# EAGLE design LightShaker-3 (EAGLE 6.6.0)
DATE: 18.07.2019; ENGINEER: ChrLin00; PAGE_TITLE: Overview; PCB_NO: E1962100; PROJECT_TITLE: LightShaker; SCH_NO: B1962200
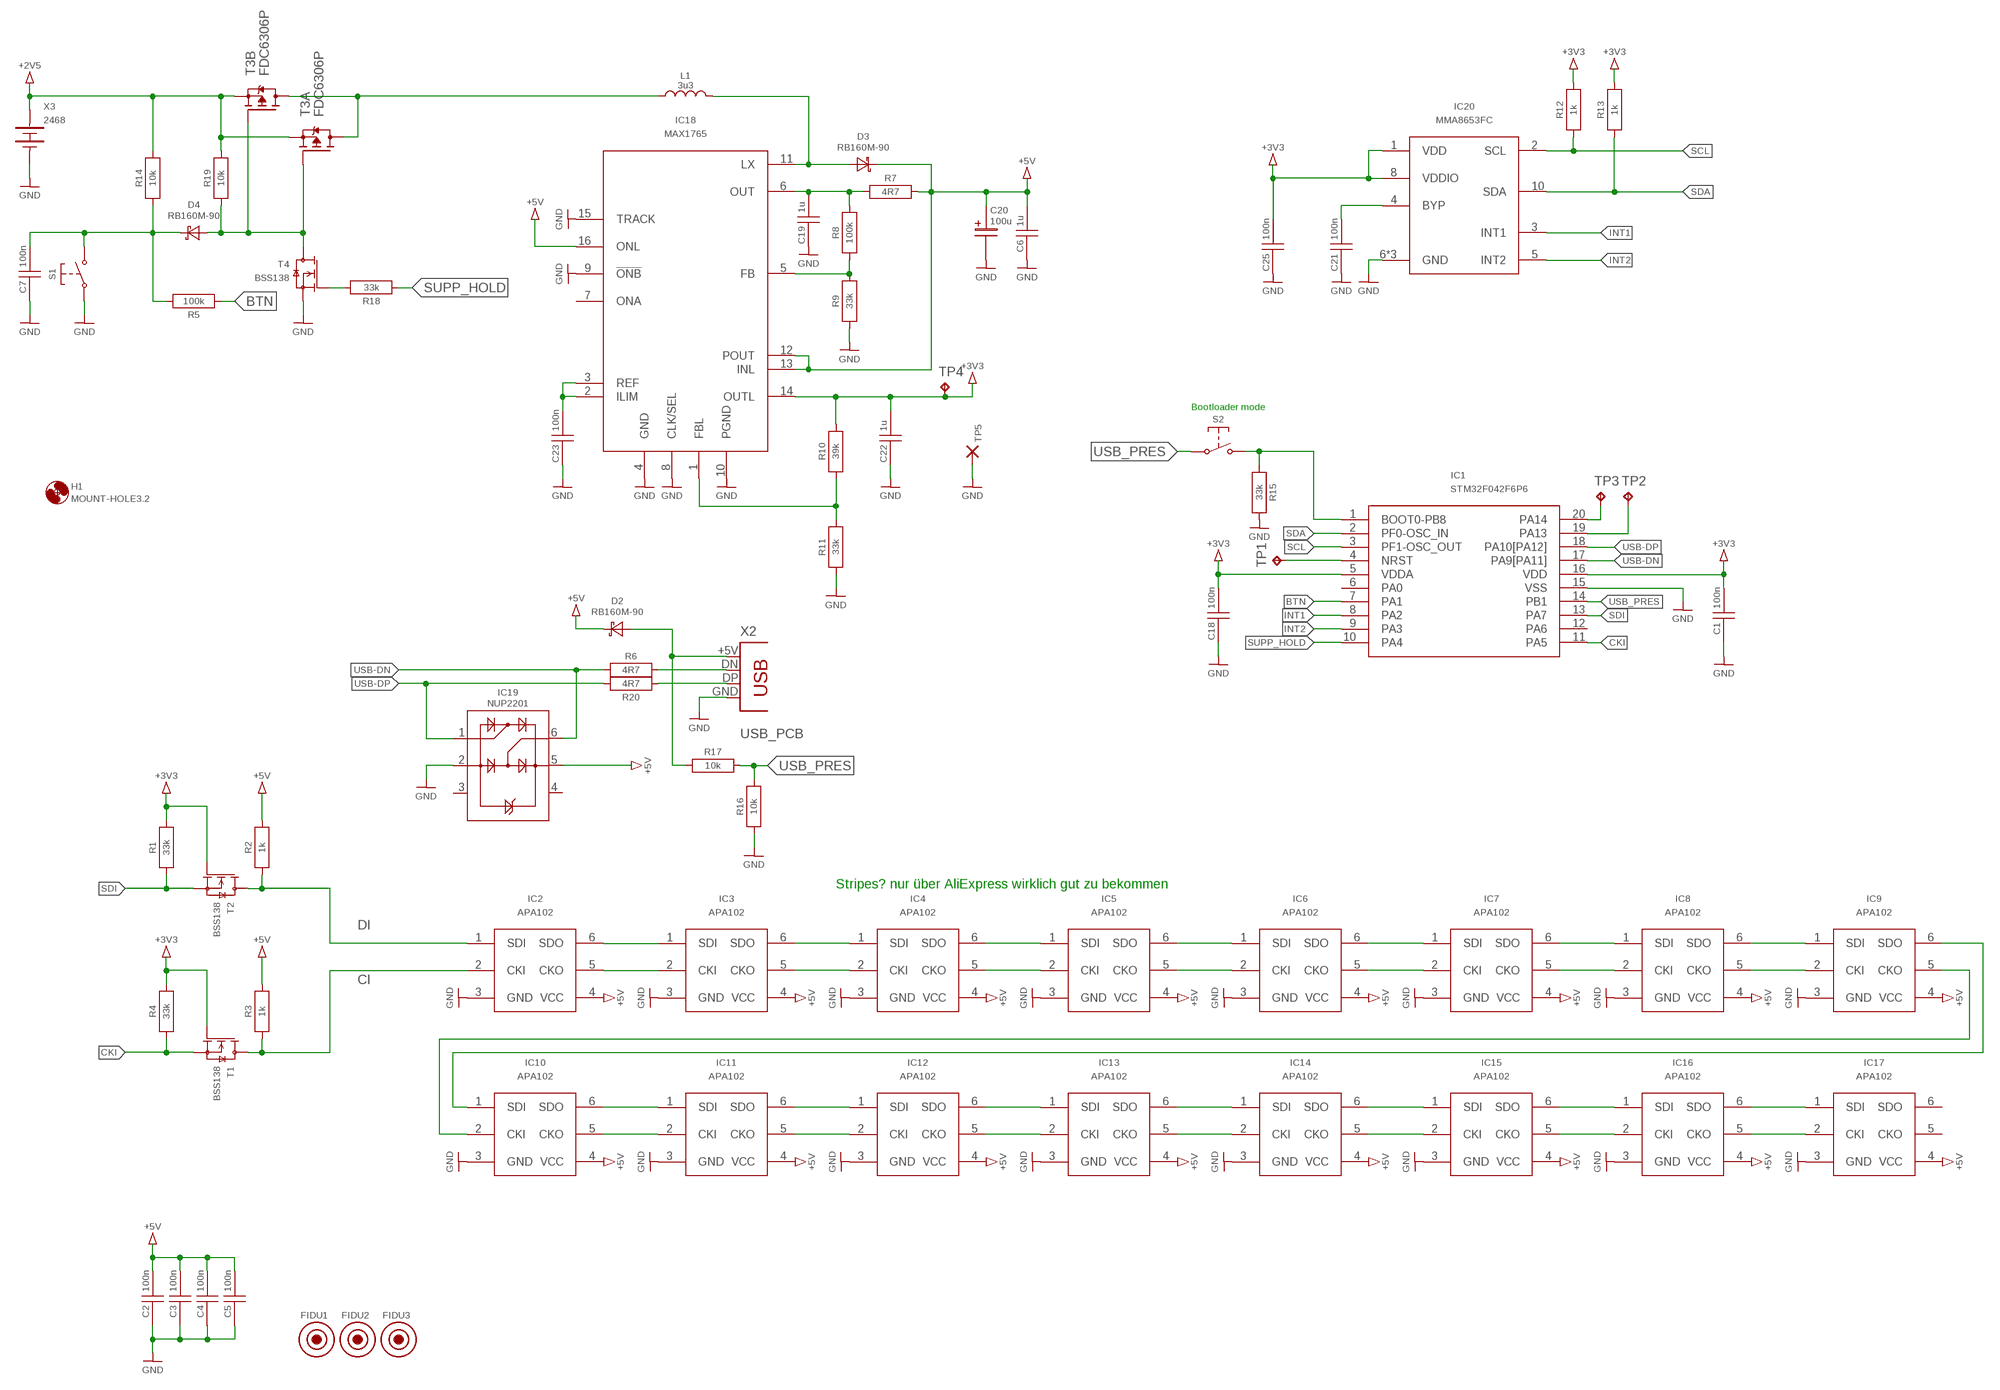
[diagram p0: schematic, sheet 1]

## Parts
C1  100n  C1206  [SM_1206]
C2  100n  C1206  [SM_1206]
C3  100n  C1206  [SM_1206]
C4  100n  C1206  [SM_1206]
C5  100n  C1206  [SM_1206]
C6  1u  C1206  [SM_1206]
C7  100n  C1206  [SM_1206]
C18  100n  C1206  [SM_1206]
C19  1u  C1206  [SM_1206]
C20  100u  CPOLSIZE-D  [SM_SIZE-D]
C21  100n  C1206  [SM_1206]
C22  1u  C1206  [SM_1206]
C23  100n  C1206  [SM_1206]
C25  100n  C1206  [SM_1206]
D2  RB160M-90  [SM_SOD123_POL]
D3  RB160M-90  [SM_SOD123_POL]
D4  RB160M-90  [SM_SOD123_POL]
FIDU1  FIDU_ROUND_NEW  [FIDUCIAL_LOETSTOPP]
FIDU2  FIDU_ROUND_NEW  [FIDUCIAL_LOETSTOPP]
FIDU3  FIDU_ROUND_NEW  [FIDUCIAL_LOETSTOPP]
H1  MOUNT-HOLE3.2  [3.2]
IC1  STM32F042F6P6  [SM_TSSOP20]
IC2  APA102  [SM_LED_PLCC6]
IC3  APA102  [SM_LED_PLCC6]
IC4  APA102  [SM_LED_PLCC6]
IC5  APA102  [SM_LED_PLCC6]
IC6  APA102  [SM_LED_PLCC6]
IC7  APA102  [SM_LED_PLCC6]
IC8  APA102  [SM_LED_PLCC6]
IC9  APA102  [SM_LED_PLCC6]
IC10  APA102  [SM_LED_PLCC6]
IC11  APA102  [SM_LED_PLCC6]
IC12  APA102  [SM_LED_PLCC6]
IC13  APA102  [SM_LED_PLCC6]
IC14  APA102  [SM_LED_PLCC6]
IC15  APA102  [SM_LED_PLCC6]
IC16  APA102  [SM_LED_PLCC6]
IC17  APA102  [SM_LED_PLCC6]
IC18  MAX1765  [SM_QSOP16]
IC19  NUP2201  [TSOP6]
IC20  MMA8653FC  [SM_DFN10]
L1  3u3  L_MOS6020  [SM_L_MOS6020]
R1  33k  R1206  [SM_1206]
R2  1k  R1206  [SM_1206]
R3  1k  R1206  [SM_1206]
R4  33k  R1206  [SM_1206]
R5  100k  R1206  [SM_1206]
R6  4R7  R1206  [SM_1206]
R7  4R7  R1206  [SM_1206]
R8  100k  R1206  [SM_1206]
R9  33k  R1206  [SM_1206]
R10  39k  R1206  [SM_1206]
R11  33k  R1206  [SM_1206]
R12  1k  R1206  [SM_1206]
R13  1k  R1206  [SM_1206]
R14  10k  R1206  [SM_1206]
R15  33k  R1206  [SM_1206]
R16  10k  R1206  [SM_1206]
R17  10k  R1206  [SM_1206]
R18  33k  R1206  [SM_1206]
R19  10k  R1206  [SM_1206]
R20  4R7  R1206  [SM_1206]
S1  PUSH-BUTTON_SMD  [PUSH-BUTTON_SMD]
S2  PUSH-BUTTON_SMD  [PUSH-BUTTON_SMD]
T1  BSS138  [SM_SOT23]
T2  BSS138  [SM_SOT23]
T3  FDC6306P  [TSOP6]
T4  BSS138  [SM_SOT23]
TP1  TPTP12R  [TP12R]
TP2  TPTP12R  [TP12R]
TP3  TPTP12R  [TP12R]
TP4  TPTP12R  [TP12R]
TP5  CHECKER_1206  [SM_RCW_1206]
X2  USB_PCB  [USB_PCB]
X3  2468  [2468]

## Nets
+2V5: R14.2 R19.2 T3.2(B:S) T3.5(A:S) X3.POS
+3V3: C1.2 C18.2 C22.2 C25.2 IC1.5(VDDA) IC1.16(VDD) IC18.14(OUTL) IC20.1(VDD) IC20.8(VDDIO) R1.2 R4.2 R10.2 R12.2 R13.2 T1.1(G) T2.1(G) TP4.TP
+5V: C2.2 C3.2 C4.2 C5.2 C6.2 C20.POS D2.C D3.C IC2.4(VCC) IC3.4(VCC) IC4.4(VCC) IC5.4(VCC) IC6.4(VCC) IC7.4(VCC) IC8.4(VCC) IC9.4(VCC) IC10.4(VCC) IC11.4(VCC) IC12.4(VCC) IC13.4(VCC) IC14.4(VCC) IC15.4(VCC) IC16.4(VCC) IC17.4(VCC) IC18.12(POUT) IC18.13(INL) IC18.16(ONL) IC19.5(VP) R2.2 R3.2 R7.2
BTN: IC1.7(PA1) R5.1
BTN1: C7.2 D4.C R5.2 R14.1 S1.3(S) S1.4(S)
CI: IC2.2(CKI) R3.1 T1.3(D)
CKI: IC1.11(PA5) R4.1 T1.2(S)
DI: IC2.1(SDI) R2.1 T2.3(D)
GATE: D4.A R19.1 T3.1(A:G) T3.3(B:G) T4.3(D)
GND: C1.1 C2.1 C3.1 C4.1 C5.1 C6.1 C7.1 C18.1 C19.1 C20.NEG C21.1 C22.1 C23.1 C25.1 IC1.15(VSS) IC2.3(GND) IC3.3(GND) IC4.3(GND) IC5.3(GND) IC6.3(GND) IC7.3(GND) IC8.3(GND) IC9.3(GND) IC10.3(GND) IC11.3(GND) IC12.3(GND) IC13.3(GND) IC14.3(GND) IC15.3(GND) IC16.3(GND) IC17.3(GND) IC18.4(GND) IC18.8(CLK/SEL) IC18.9(!ONB) IC18.10(PGND) IC18.15(TRACK) IC19.2(GND) IC20.6(GND) IC20.7(GND) IC20.9(GND) R9.1 R11.1 R15.2 R16.1 S1.1(P) S1.2(P) T4.2(S) TP5.1(P) X2.GND X3.NEG
INT1: IC1.8(PA2) IC20.3(INT1)
INT2: IC1.9(PA3) IC20.5(INT2)
N$1: IC2.6(SDO) IC3.1(SDI)
N$2: IC2.5(CKO) IC3.2(CKI)
N$3: R18.2 T4.1(G)
N$4: IC3.6(SDO) IC4.1(SDI)
N$5: IC3.5(CKO) IC4.2(CKI)
N$6: R20.1 X2.DP
N$7: IC4.6(SDO) IC5.1(SDI)
N$8: IC4.5(CKO) IC5.2(CKI)
N$9: R6.2 X2.DN
N$10: IC6.6(SDO) IC7.1(SDI)
N$11: IC6.5(CKO) IC7.2(CKI)
N$13: IC7.6(SDO) IC8.1(SDI)
N$14: IC7.5(CKO) IC8.2(CKI)
N$15: L1.1 T3.4(B:D) T3.6(A:D)
N$16: IC8.6(SDO) IC9.1(SDI)
N$17: IC8.5(CKO) IC9.2(CKI)
N$18: IC1.4(NRST) TP1.TP
N$19: IC10.6(SDO) IC11.1(SDI)
N$20: IC10.5(CKO) IC11.2(CKI)
N$21: IC1.1(BOOT0-PB8) R15.1 S2.3(S) S2.4(S)
N$22: IC11.6(SDO) IC12.1(SDI)
N$23: IC11.5(CKO) IC12.2(CKI)
N$24: IC1.20(PA14) TP3.TP
N$25: IC12.6(SDO) IC13.1(SDI)
N$26: IC12.5(CKO) IC13.2(CKI)
N$27: IC1.19(PA13) TP2.TP
N$28: IC14.6(SDO) IC15.1(SDI)
N$29: IC14.5(CKO) IC15.2(CKI)
N$31: IC15.6(SDO) IC16.1(SDI)
N$32: IC15.5(CKO) IC16.2(CKI)
N$33: C19.2 IC18.6(OUT) R7.1 R8.2
N$34: IC16.6(SDO) IC17.1(SDI)
N$35: IC16.5(CKO) IC17.2(CKI)
N$36: IC18.5(FB) R8.1 R9.2
N$37: D3.A IC18.11(LX) L1.2
N$38: IC5.5(CKO) IC6.2(CKI)
N$39: IC5.6(SDO) IC6.1(SDI)
N$40: IC18.1(FBL) R10.1 R11.2
N$41: IC9.5(CKO) IC10.2(CKI)
N$42: IC9.6(SDO) IC10.1(SDI)
N$44: IC13.5(CKO) IC14.2(CKI)
N$45: IC13.6(SDO) IC14.1(SDI)
N$46: C21.2 IC20.4(BYP)
N$48: C23.2 IC18.2(ILIM) IC18.3(REF)
SCL: IC1.3(PF1-OSC_OUT) IC20.2(SCL) R12.1
SDA: IC1.2(PF0-OSC_IN) IC20.10(SDA) R13.1
SDI: IC1.13(PA7) R1.1 T2.2(S)
SUPP_HOLD: IC1.10(PA4) R18.1
USB-DN: IC1.17(PA9[PA11]) IC19.6(IO2) R6.1
USB-DP: IC1.18(PA10[PA12]) IC19.1(IO1) R20.2
USB_PRES: IC1.14(PB1) R16.2 R17.2 S2.1(P) S2.2(P)
VUSB: D2.A R17.1 X2.+5V
Unconnected: IC1.6(PA0) IC1.12(PA6) IC17.5(CKO) IC17.6(SDO) IC18.7(ONA) IC19.3(NC1) IC19.4(NC2)

## Notes on the sheet
- Bootloader mode
- Stripes? nur über AliExpress wirklich gut zu bekommen

## Library data of the parts
C1-C5 C7 C18 C21 C23 C25 = DTP_RCL:C: Capacitor IMS: IMS Capacitors <file:\\omicron.at\dfs\GLOBAL\OMICRON\Synergies\Innovation\Components\CompIMS\_html\Capacitor.html> Version Date Employee Description 1.2 2018-10-02 NorChr00 added 2220 Package 1.1 2018-09-11 MarAig00 added 0402 Package 1.0 2015-07-15 ChrRaj00 Initial Version; MECHPART: FALSE; PARTNR: E0001400; PLACEHOLDER: FALSE
C6 C19 C22 = DTP_RCL:C: Capacitor IMS: IMS Capacitors <file:\\omicron.at\dfs\GLOBAL\OMICRON\Synergies\Innovation\Components\CompIMS\_html\Capacitor.html> Version Date Employee Description 1.2 2018-10-02 NorChr00 added 2220 Package 1.1 2018-09-11 MarAig00 added 0402 Package 1.0 2015-07-15 ChrRaj00 Initial Version; MECHPART: FALSE; PARTNR: E0487200; PLACEHOLDER: FALSE
C20 = DTP_RCL:CPOL: Capacitor IMS: IMS Capacitors polarized <file:\\omicron.at\dfs\GLOBAL\OMICRON\Synergies\Innovation\Components\CompIMS\_html\Capacitor_Polarized.html> Version Date Employee Description 1.0 2015-08-26 ChrRaj00 Initial Version; MECHPART: FALSE; PARTNR: E0242200; PLACEHOLDER: FALSE
D2-D4 = Diode:RB160M-90: Diode RB160M-90 Vr = 90V Vf = 0.73V If = 1A Cj = 12pF IMS: E0617200 <file:\\omicron.at\dfs\GLOBAL\OMICRON\Synergies\Innovation\Components\CompIMS\Diode\Schottky\E0617200_RB160M-90\E0617200.html> History Version Date Employee Description 1.0 2015-08-10 ChrRaj00 InitialVersion; PARTNR: E0617200
FIDU1-FIDU3 = DTP_Misc:FIDU_ROUND_NEW: Use this Fiducial for new projects!! Fiducial filled with solder mask Place holder for the partlist - needed for production Put FIDU1 on (0,0) position! History Version Date Employee Description 1.0r0 2018.05.07 NorChr00 Add E-Part "number" for Fiducials 1.0 201?.04.21 ???? Initial Version; PARTNR: E0FIDU00
H1 = DTP_Misc:MOUNT-HOLE: MOUNTING HOLE with drill center marker Version Date Employee Description 1.2 2018-10-04 NorChr00 add attributes "PLACEHOLDER and REMARK -> now they are ignored in P&P and BOM 1.1 2016-01-27 MarStr00 Renamed packages with period instead of comma, to help Excel imports 1.0 2015-12-05 MarStr00 Initial Version, copied from holes.lbr and touched up; PLACEHOLDER: TRUE; REMARK: Mounting hole
IC1 = POVLibrary:STM32F042F6P6; PARTNR: P1480012
IC2-IC17 = POVLibrary:APA102; PARTNR: P1480014
IC18 = POVLibrary:MAX1765; PARTNR: P1480011
IC19 = DTP_IC:NUP2201: ESD Protection Diodes with Low Clamping Voltage NUP2201MR6 IMS: E0439000 <file://omicron.at/dfs/GLOBAL/OMICRON/Synergies/Innovation/Components/CompIMS/Diode/TVS/E0439000_NUP2201MR6/E0439000.html> Version Date Employee Description 1.0 ? ? Initial Version 1.1 2016-04-12 MarSch06 added description; PARTNR: E0439000
IC20 = POVLibrary:MMA8653FC; PARTNR: P1480013
L1 = DTP_RCL:L: Inductor IMS: IMS Inductors <file:\\omicron.at\dfs\GLOBAL\OMICRON\Synergies\Innovation\Components\CompIMS\_html\Inductor.html> Version Date Employee Description 1.0 2015-07-15 ChrRaj00 Initial Version; PARTNR: E0517800
R1 R4 R9 R11 R15 R18 = DTP_RCL:R: Resistor IMS: IMS Resistors <file:\\omicron.at\dfs\GLOBAL\OMICRON\Synergies\Innovation\Components\CompIMS\_html\Resistor_Standard.html> Version Date Employee Description 1.10 2018-10-02 NorChr00 Added 2010 Package 1.9 2018-09-11 MarAiig00 Added 0402 Package 1.8 2018-07-17 ChrRaj00 Added TO247 flat incl. packages 1.7 2018-04-17 MarStr00 Added TH_RES_PR03 and TH_RES_PR02 packages 1.6 2017-08-23 MarStr00 Added Multicomp MCKNP 7W and 5W packages 1.5 2017-02-27 MarStr00 Added TE SQP5 Package 1.4 2015-10-20 MarAig00 Added 4723 Package 1.3 2015-10-08 MarStr00 Added KH208-8 package 1.2 2015-10-01 MarStr00 Added 1218 package 1.1 2015-09-14 MarStr00 Added MELF0207 and 2512 packages 1.0 2015-07-15 ChrRaj00 Initial Version; MECHPART: FALSE; PARTNR: E0149800; PLACEHOLDER: FALSE
R2 R3 R12 R13 = DTP_RCL:R: Resistor IMS: IMS Resistors <file:\\omicron.at\dfs\GLOBAL\OMICRON\Synergies\Innovation\Components\CompIMS\_html\Resistor_Standard.html> Version Date Employee Description 1.10 2018-10-02 NorChr00 Added 2010 Package 1.9 2018-09-11 MarAiig00 Added 0402 Package 1.8 2018-07-17 ChrRaj00 Added TO247 flat incl. packages 1.7 2018-04-17 MarStr00 Added TH_RES_PR03 and TH_RES_PR02 packages 1.6 2017-08-23 MarStr00 Added Multicomp MCKNP 7W and 5W packages 1.5 2017-02-27 MarStr00 Added TE SQP5 Package 1.4 2015-10-20 MarAig00 Added 4723 Package 1.3 2015-10-08 MarStr00 Added KH208-8 package 1.2 2015-10-01 MarStr00 Added 1218 package 1.1 2015-09-14 MarStr00 Added MELF0207 and 2512 packages 1.0 2015-07-15 ChrRaj00 Initial Version; MECHPART: FALSE; PARTNR: E0002500; PLACEHOLDER: FALSE
R5 R6 R10 R20 = DTP_RCL:R: Resistor IMS: IMS Resistors <file:\\omicron.at\dfs\GLOBAL\OMICRON\Synergies\Innovation\Components\CompIMS\_html\Resistor_Standard.html> Version Date Employee Description 1.10 2018-10-02 NorChr00 Added 2010 Package 1.9 2018-09-11 MarAiig00 Added 0402 Package 1.8 2018-07-17 ChrRaj00 Added TO247 flat incl. packages 1.7 2018-04-17 MarStr00 Added TH_RES_PR03 and TH_RES_PR02 packages 1.6 2017-08-23 MarStr00 Added Multicomp MCKNP 7W and 5W packages 1.5 2017-02-27 MarStr00 Added TE SQP5 Package 1.4 2015-10-20 MarAig00 Added 4723 Package 1.3 2015-10-08 MarStr00 Added KH208-8 package 1.2 2015-10-01 MarStr00 Added 1218 package 1.1 2015-09-14 MarStr00 Added MELF0207 and 2512 packages 1.0 2015-07-15 ChrRaj00 Initial Version; MECHPART: FALSE; PLACEHOLDER: FALSE
R7 = DTP_RCL:R: Resistor IMS: IMS Resistors <file:\\omicron.at\dfs\GLOBAL\OMICRON\Synergies\Innovation\Components\CompIMS\_html\Resistor_Standard.html> Version Date Employee Description 1.10 2018-10-02 NorChr00 Added 2010 Package 1.9 2018-09-11 MarAiig00 Added 0402 Package 1.8 2018-07-17 ChrRaj00 Added TO247 flat incl. packages 1.7 2018-04-17 MarStr00 Added TH_RES_PR03 and TH_RES_PR02 packages 1.6 2017-08-23 MarStr00 Added Multicomp MCKNP 7W and 5W packages 1.5 2017-02-27 MarStr00 Added TE SQP5 Package 1.4 2015-10-20 MarAig00 Added 4723 Package 1.3 2015-10-08 MarStr00 Added KH208-8 package 1.2 2015-10-01 MarStr00 Added 1218 package 1.1 2015-09-14 MarStr00 Added MELF0207 and 2512 packages 1.0 2015-07-15 ChrRaj00 Initial Version; MECHPART: FALSE; PARTNR: E0821300; PLACEHOLDER: FALSE
R8 R19 = DTP_RCL:R: Resistor IMS: IMS Resistors <file:\\omicron.at\dfs\GLOBAL\OMICRON\Synergies\Innovation\Components\CompIMS\_html\Resistor_Standard.html> Version Date Employee Description 1.10 2018-10-02 NorChr00 Added 2010 Package 1.9 2018-09-11 MarAiig00 Added 0402 Package 1.8 2018-07-17 ChrRaj00 Added TO247 flat incl. packages 1.7 2018-04-17 MarStr00 Added TH_RES_PR03 and TH_RES_PR02 packages 1.6 2017-08-23 MarStr00 Added Multicomp MCKNP 7W and 5W packages 1.5 2017-02-27 MarStr00 Added TE SQP5 Package 1.4 2015-10-20 MarAig00 Added 4723 Package 1.3 2015-10-08 MarStr00 Added KH208-8 package 1.2 2015-10-01 MarStr00 Added 1218 package 1.1 2015-09-14 MarStr00 Added MELF0207 and 2512 packages 1.0 2015-07-15 ChrRaj00 Initial Version; MECHPART: FALSE; PARTNR: E0002800; PLACEHOLDER: FALSE
R14 R16 R17 = DTP_RCL:R: Resistor IMS: IMS Resistors <file:\\omicron.at\dfs\GLOBAL\OMICRON\Synergies\Innovation\Components\CompIMS\_html\Resistor_Standard.html> Version Date Employee Description 1.10 2018-10-02 NorChr00 Added 2010 Package 1.9 2018-09-11 MarAiig00 Added 0402 Package 1.8 2018-07-17 ChrRaj00 Added TO247 flat incl. packages 1.7 2018-04-17 MarStr00 Added TH_RES_PR03 and TH_RES_PR02 packages 1.6 2017-08-23 MarStr00 Added Multicomp MCKNP 7W and 5W packages 1.5 2017-02-27 MarStr00 Added TE SQP5 Package 1.4 2015-10-20 MarAig00 Added 4723 Package 1.3 2015-10-08 MarStr00 Added KH208-8 package 1.2 2015-10-01 MarStr00 Added 1218 package 1.1 2015-09-14 MarStr00 Added MELF0207 and 2512 packages 1.0 2015-07-15 ChrRaj00 Initial Version; MECHPART: FALSE; PARTNR: E0002700; PLACEHOLDER: FALSE
S1 S2 = DTP_Switch:PUSH-BUTTON_SMD: Push Button Switch For SMD mounting Max Switching: 50mA @ 12V Switches:1 E-Nr.: E0869600 History Version Date Employee Description 1.0 2015.04.23 DanWin00 Initial Version; PARTNR: E0869600
T1 T2 T4 = FET:BSS138: BSS138 NMOSFET 50V 0.2A 3E5 SOT23 Vmax = 50V Icont =0.2A Pd = 360mW Rdson = 3.5Ohm IMS: E0277100 <file:\\omicron.at\dfs\GLOBAL\OMICRON\Synergies\Innovation\Components\CompIMS\Transistor\NMOS\E0277100_BSS138\E0277100.html> History Version Date Employee Description 1.0 2015-11-13 ChrRaj00 Initial Version; PARTNR: E0277100
T3 = DTP_Semicond:FDC6306P; PARTNR: E0662100
TP1-TP4 = DTP_Connectors:TP: Test pad
TP5 = DTP_Connectors:CHECKER_1206: Checker 1p 1206 SMD RCWCTE IMS: E0395500 <\\omicron.at\DFS\GLOBAL\OMICRON\Synergies\Innovation\Components\CompIMS\Connector\5-PCB/E0395500_Checker_1p_1206_SMD_RCWCTE/E0395500.html> History Version Date Employee Description 1.1 2015.09.15 MarStr00 Value now visible on silkscreen for labeling 1.0 2014.09.05 ChrJoc00 Added prefix and description; PARTNR: E0395500
X2 = POVLibrary:USB_PCB
X3 = POVLibrary:2468

## Board
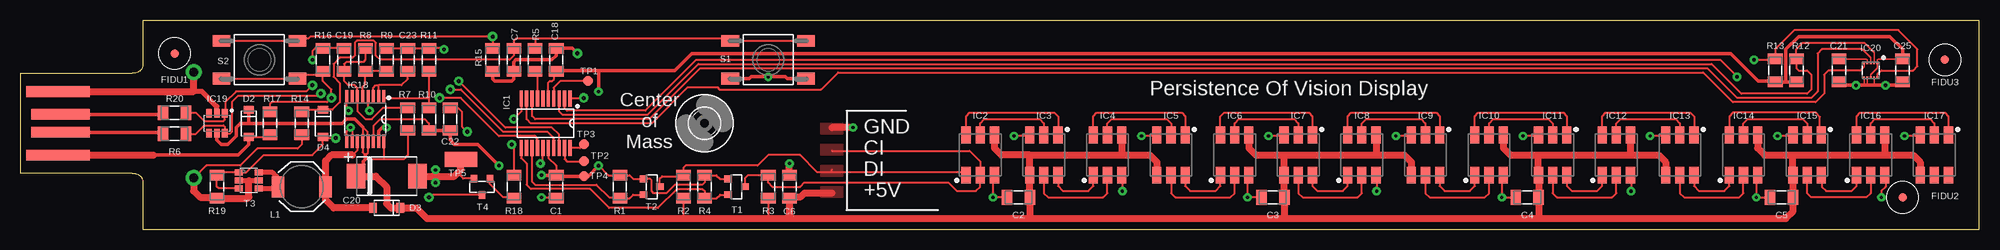
[diagram p1: board, top side]
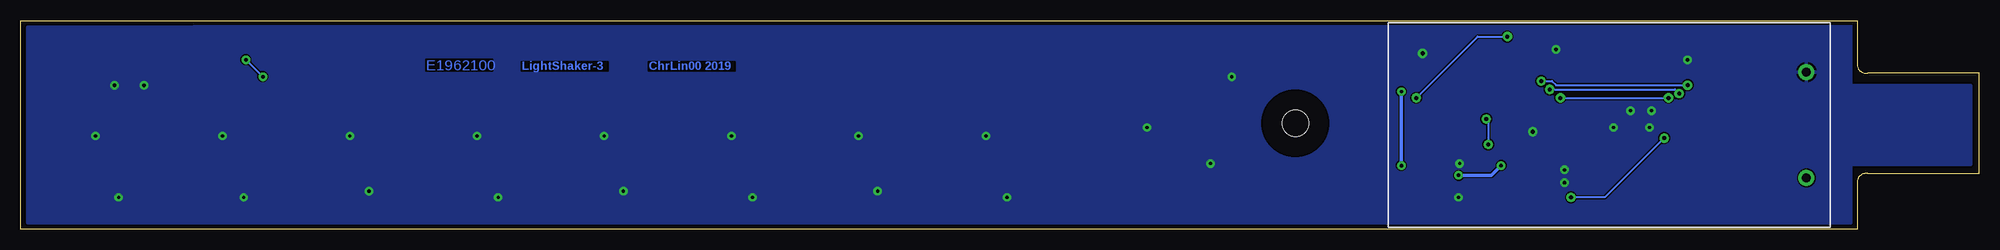
[diagram p2: board, bottom side, seen from below]

Size 234.6 x 25 mm. Coordinates in mm from the lower left corner, seen from the top.
Outline: 13.33,18.73 13.61,18.73 arc90 14.6,19.73 14.6,25 234.6,25 234.6,0 14.6,0 14.6,5.67 arc90 13.61,6.67 13.33,6.67
Copper layers (1*16): Top 0.035mm / dielectric 1.5mm / Bottom 0.035mm
Design rules "OMICRON_2Layer": minimum track width 6mil, minimum drill 0.3mm, track to track 6mil, track to pad 6mil, pad to pad 6mil, via to via 6mil, smd to smd 6mil, copper to edge 0.5mm, drill to drill 0.3mm, minimum pad ring 12mil, minimum via ring 12mil, stop-mask expansion 0mil, vias tented up to drill 0.3mm, thermal gap 10mil

### Footprints (pad centres in the part's own frame; a part is rotated, then mirrored left to right if it is on the bottom)
SM_1206 = smd 1.25 x 1.75: 1 -1.375,0; 2 1.375,0
SM_SIZE-D = smd 2.2 x 2.9: NEG 3.683,0; POS -3.683,0
SM_SOD123_POL = smd 0.92 x 1.22: A -1.64,0; C 1.64,0
FIDUCIAL_LOETSTOPP = smd 1.016 x 1.016: P$1 0,0
3.2 = hole 3.2: 0,0
SM_TSSOP20 = smd 0.4 x 1.88: 1 -2.925,-2.97; 2 -2.275,-2.97; 3 -1.625,-2.97; 4 -0.975,-2.97; 5 -0.325,-2.97; 6 0.325,-2.97; 7 0.975,-2.97; 8 1.625,-2.97; 9 2.275,-2.97; 10 2.925,-2.97; 11 2.925,2.97; 12 2.275,2.97; 13 1.625,2.97; 14 0.975,2.97; 15 0.325,2.97; 16 -0.325,2.97; 17 -0.975,2.97; 18 -1.625,2.97; 19 -2.275,2.97; 20 -2.925,2.97
SM_LED_PLCC6 = smd 2 x 1.1: 1 -2.4,1.7; 2 -2.4,0; 3 -2.4,-1.7; 4 2.4,-1.7; 5 2.4,0; 6 2.4,1.7
SM_QSOP16 = smd 0.36 x 1.6: 1 -2.223,-2.655; 2 -1.587,-2.655; 3 -0.953,-2.655; 4 -0.318,-2.655; 5 0.318,-2.655; 6 0.953,-2.655; 7 1.587,-2.655; 8 2.223,-2.655; 9 2.223,2.655; 10 1.587,2.655; 11 0.953,2.655; 12 0.318,2.655; 13 -0.318,2.655; 14 -0.953,2.655; 15 -1.587,2.655; 16 -2.223,2.655
TSOP6 = smd 1 x 0.7: 1 -1.2,0.95; 2 -1.2,0; 3 -1.2,-0.95; 4 1.2,-0.95; 5 1.2,0; 6 1.2,0.95
SM_DFN10 = smd 0.3 x 0.225: 1 -0.9,0.8; 2 -0.9,0.4; 3 -0.9,0; 4 -0.9,-0.4; 5 -0.9,-0.8; 6 0.9,-0.8; 7 0.9,-0.4; 8 0.9,0; 9 0.9,0.4; 10 0.9,0.8
SM_L_MOS6020 = smd 1.52 x 2.54: 1 2.857,0; 2 -2.857,0
PUSH-BUTTON_SMD = smd 2.1 x 1.4: 1 -4.55,2.25; 2 4.55,2.25; 3 -4.55,-2.25; 4 4.55,-2.25
SM_SOT23 = smd 0.8 x 0.9: 1 -0.95,-1; 2 0.95,-1; 3 0,1
TP12R = smd 1.2 x 1.2: TP 0,0
SM_RCW_1206 = smd 1.8 x 3.9: 1 0,0
USB_PCB = smd 1.27 x 7.62: +5V -3.81,8.89; GND 3.81,8.89 | smd 1.27 x 6.985: DN -1.079,8.572; DP 1.079,8.572
2468 = drill 1.1 pad 1.93: NEG 23.625,6.35; POS 23.625,-6.35

### Placement (x,y rotation side)
C1  64.13,5.08 90 top
C2  119.51,3.81 0 top
C3  149.99,3.81 0 top
C4  180.47,3.81 0 top
C5  210.95,3.81 0 top
C6  92.07,5.08 270 top
C7  59.05,20.32 90 top
C18  64.13,20.32 270 top
C19  38.73,20.32 270 top
C20  43.81,6.35 0 top
C21  217.8,19.05 90 top
C22  51.44,13.21 270 top
C23  46.36,20.32 270 top
C25  225.42,19.05 90 top
D2  27.3,12.7 90 top
D3  43.81,2.54 0 top
D4  36.2,12.7 90 top
FIDU1  18.41,21.08 90 top
FIDU2  225.42,3.81 90 top
FIDU3  230.5,20.32 180 top
H1  81.91,12.7 0 top
IC1  62.87,12.7 180 top
IC2  114.94,8.89 90 top
IC3  122.56,8.89 270 top
IC4  130.18,8.89 90 top
IC5  137.79,8.89 270 top
IC6  145.41,8.89 90 top
IC7  153.03,8.89 270 top
IC8  160.66,8.89 90 top
IC9  168.28,8.89 270 top
IC10  175.89,8.89 90 top
IC11  183.51,8.89 270 top
IC12  191.13,8.89 90 top
IC13  198.75,8.89 270 top
IC14  206.38,8.89 90 top
IC15  214,8.89 270 top
IC16  221.61,8.89 90 top
IC17  229.23,8.89 270 top
IC18  41.27,13.21 180 top
IC19  23.49,12.7 270 top
IC20  221.61,19.05 270 top
L1  33.66,5.08 180 top
R1  71.75,5.08 90 top
R2  79.38,5.08 270 top
R3  89.53,5.08 270 top
R4  81.91,5.08 90 top
R5  61.59,20.32 90 top
R6  18.41,11.43 180 top
R7  46.36,13.21 270 top
R8  41.27,20.32 90 top
R9  43.81,20.32 270 top
R10  48.89,13.21 270 top
R11  48.89,20.32 270 top
R12  212.72,19.05 270 top
R13  210.19,19.05 270 top
R14  33.66,12.7 270 top
R15  56.52,20.32 270 top
R16  36.2,20.32 270 top
R17  29.84,12.7 90 top
R18  59.05,5.08 270 top
R19  23.49,5.08 270 top
R20  18.41,13.97 0 top
S1  89.53,20.32 180 top
S2  28.57,20.32 180 top
T1  85.72,5.08 270 top
T2  75.56,5.08 270 top
T3  27.3,5.84 0 top
T4  55.24,5.08 180 top
TP1  67.94,17.78 180 top
TP2  67.44,8.13 180 top
TP3  67.44,10.16 180 top
TP4  67.44,6.35 0 top
TP5  52.7,8.38 90 top
U$2  [DOCFIELD]  53.98,-64.01 0 top  (outside the outline)
X2  13.33,12.7 90 top
X3  44.32,12.5 0 bottom

### Tracks (layer width: path | path; a pad name or v marks a point on that pad's centre or on a via)
+2V5
  Top 0.254: R14.2 33.66,10.16 33.15,9.65 28.32,9.65 26.29,7.62 22.22,7.62 20.75,6.15 X3.POS
  Top 0.61: T3.2 27.3,5.84 T3.5
  Top 0.813: X3.POS 20.7,4.57 21.46,3.81 23.39,3.81 R19.2 27.2,3.71 27.3,3.81 27.3,5.84
+3V3  (via drill 0.4)
  Top 0.2: C25.2 222.52,20.43 222.41,20.32 IC20.1 222.41,19.34 221.61,18.54 IC20.8
  Top 0.254: T1.1 83.76,6.03 83.33,6.46 R4.2 81.91,5.59 81.66,5.33 78.36,5.33 77.34,4.32 75.82,4.32 75.56,4.57 75.56,5.84 75.38,6.03 T2.1 73.34,6.03 72.92,6.46 R1.2 70.38,6.46 v69.22,7.62 | IC1.5 63.19,17.6 63.37,17.78 63.63,17.78 63.88,18.03 63.88,18.69 C18.2 | R10.2 48.89,12.7 48.39,13.21 43.05,13.21 42.23,12.38 IC18.14 | IC1.16 63.19,8.57 64.13,7.62 C1.2
  Top 0.406: 225.42,20.32 C25.2 225.42,21.59 223.9,23.11 212.98,23.11 211.45,21.59 211.45,17.68 | 211.45,17.68 R13.2 210.19,17.78 208.15,17.78 204.85,21.08 80.39,21.08 78.36,19.05 69.22,19.05 | R12.2 211.45,17.68 | R10.2 C22.2 51.44,10.67 51.94,10.16 54.74,10.16 v57.28,7.62 | v69.22,16.51 69.22,19.05 | v62.36,6.46 C1.2 64.24,6.35 TP4.TP 67.94,6.35 v69.22,7.62 | 69.22,19.05 64.24,19.05 C18.2
  Bottom 0.406: v57.28,7.62 58.44,6.46 v62.36,6.46 | v69.22,16.51 v69.22,7.62
+5V
  Top 0.254: IC18.13 41.59,9.21 41.27,8.89 40.96,9.21 IC18.12 40.96,12.26 41.53,11.68 41.53,10.67 | R7.2 46.36,8.89 45.85,8.38 43.5,8.38 | 43.5,8.38 41.27,8.38 | IC18.16 43.5,8.38 | R2.2 79.38,1.27 | R3.2 89.53,1.27
  Top 0.406: 41.27,8.89 41.27,8.38 41.02,8.13 41.02,6.35 C20.POS | 40.96,12.26 40,13.21 38.99,13.21 38.48,12.7 27.3,12.7 | 27.3,12.7 D2.C | IC19.5 23.49,10.67 24,10.16 24.77,10.16 25.78,11.18 25.78,12.19 26.29,12.7 27.3,12.7
  Top 0.813: 120.85,8.89 IC3.4 120.88,6.46 C2.2 120.88,1.27 | 120.85,8.89 117.47,8.89 116.63,9.73 IC2.4 | 120.85,8.89 131.88,8.89 | 131.88,8.89 135.25,8.89 136.09,8.05 IC5.4 | IC4.4 131.88,8.89 | IC6.4 147.11,9.73 147.95,8.89 151.33,8.89 | 151.33,8.89 162.35,8.89 | 162.35,8.89 165.73,8.89 166.57,8.05 IC9.4 | IC8.4 162.35,8.89 | 151.33,8.89 IC7.4 151.36,6.46 C3.2 151.36,1.27 | IC10.4 177.59,9.73 178.44,8.89 181.81,8.89 | 181.81,8.89 192.83,8.89 | 192.83,8.89 196.22,8.89 197.05,8.05 IC13.4 | 181.81,8.89 IC11.4 181.84,6.46 C4.2 181.84,1.27 | IC12.4 192.83,8.89 | IC14.4 208.07,9.73 208.91,8.89 212.29,8.89 | 212.29,8.89 223.31,8.89 | 223.31,8.89 226.69,8.89 227.53,8.05 IC17.4 | IC16.4 223.31,8.89 | 212.29,8.89 IC15.4 212.29,3.81 C5.2 212.32,2.14 211.45,1.27 181.84,1.27 | 92.07,1.27 89.53,1.27 79.38,1.27 48.64,1.27 47.37,2.54 D3.C 44.32,2.54 43.81,3.05 43.81,5.08 42.55,6.35 41.02,6.35 | 92.07,1.27 120.88,1.27 | 120.88,1.27 151.36,1.27 | 151.36,1.27 181.84,1.27 | 92.07,1.27 C6.2 92.07,3.81 93.34,3.81 93.85,4.32 97.16,4.32
  pour Top: 95.88,3.81 95.88,5.08 98.43,5.08 98.43,3.81
BTN
  Top 0.254: R5.1 61.89,18.65 IC1.7
BTN1
  Top 0.254: S1.3 S1.4 84.69,22.86 61.59,22.86 | 61.59,22.86 59.31,22.86 59.05,22.61 C7.2 59.05,20.83 58.55,20.32 43.05,20.32 42.55,20.83 42.55,22.35 42.29,22.61 40.26,22.61 40,22.35 40,20.83 39.75,20.57 38.23,20.57 37.47,19.81 37.47,18.29 38.23,17.53 38.23,15.24 37.33,14.34 D4.C 33.92,14.34 R14.1 | 61.59,22.86 R5.2
CI
  Top 0.254: 97.16,9.4 113.66,9.4 114.94,8.13 IC2.2 114.94,5.08 114.43,4.57 112.14,4.57 111.12,5.59 93.85,5.59 93.34,5.08 90.04,5.08 89.53,5.59 R3.1 87.1,6.46 86.74,6.1 86.74,5.1 T1.3
  pour Top: 95.88,8.89 95.88,10.16 98.43,10.16 98.43,8.89
CKI
  Top 0.254: T1.2 83.76,4.13 83.33,3.71 R4.1 81.91,4.57 81.66,4.83 78.61,4.83 76.33,2.54 70.48,2.54 68.2,4.83 61.09,4.83 60.58,5.33 60.58,7.87 59.94,8.51 IC1.11
DI
  Top 0.254: 97.16,6.86 95.38,6.86 93.34,8.89 89.53,8.89 88.26,7.62 79.63,7.62 79.38,7.37 R2.1 79.27,6.35 76.84,6.35 76.56,6.08 T2.3 | 97.16,6.86 112.9,6.86 113.27,6.49 IC2.1 | 97.16,6.86 97.16,7.11
  pour Top: 95.88,6.35 95.88,7.62 98.43,7.62 98.43,6.35
GATE  (via drill 0.5)
  Top 0.254: T4.3 49.16,4.08 v48.89,3.81 | v37.72,10.92 36.33,10.92 D4.A 36.2,10.16 34.92,8.89 29.08,8.89 26.98,6.79 T3.1 23.83,6.79 R19.1 23.49,5.08 23.68,4.89 T3.3
  Bottom 0.254: v37.72,10.92 44.83,3.81 v48.89,3.81
GND  (via drill 0.4, 0.5)
  Top 0.2: 220.81,17.78 IC20.6 220.81,17.27 | IC20.9 222.01,17.27 221.61,17.27 221.22,17.27 IC20.7
  Top 0.254: IC18.10 39.69,12 v39.5,12.19 39.05,11.75 IC18.9 | v41.78,14.22 41.59,14.54 IC18.4 | R9.1 C23.1 R11.1 50.57,21.7 v50.67,21.59 | v62.23,7.87 62.54,8.18 IC1.15 | 64.64,21.84 64.49,21.7 C18.1 | C2.1 v116.46,3.81 116.46,6.31 IC2.3 | IC17.3 227.42,11.18 v225.68,11.18 | IC16.3 223.39,6.41 223.39,5.08 222.88,4.57 v222.88,3.81 | C5.1 v207.9,3.81 207.9,6.31 IC14.3 | IC15.3 212.18,11.18 v210.44,11.18 | IC13.3 196.94,11.18 v195.2,11.18 | IC12.3 192.91,6.41 v192.91,4.57 | IC4.3 131.95,6.41 v131.95,4.57 | IC5.3 135.98,11.18 v134.24,11.18 | IC3.3 120.74,11.18 v119,11.18 | IC7.3 151.22,11.18 v149.48,11.18 | IC6.3 146.94,6.31 v146.94,3.81 C3.1 | IC8.3 162.43,6.41 v162.43,4.57 | IC9.3 166.46,11.18 v164.72,11.18 | IC11.3 181.7,11.18 v179.96,11.18 | IC10.3 177.42,6.31 v177.42,3.81 C4.1 | v53.47,11.68 52.83,12.32 52.83,14.1 52.45,14.48 51.54,14.48 C22.1 | C19.1 38.63,21.59 38.52,21.7 R16.1 35.28,21.7 34.92,21.34 v34.92,20.32 | v62.36,3.81 64.03,3.81 C1.1 | T4.2 52.98,6.08 52.32,6.73 | v39.24,14.22 39.05,14.41 IC18.8
  Top 0.406: C21.1 217.8,17.27 v219.84,17.27 220.81,17.27 221.61,17.27 v223.39,17.27 224.92,17.27 224.92,17.68 C25.1 | S1.2 87.28,18.07 87.5,18.29 v89.53,18.29 91.57,18.29 91.78,18.07 S1.1 | IC18.15 42.86,11.75 43.31,12.19 v43.81,12.19 | v66.67,21.08 66.06,21.7 C18.1 64.13,20.83 63.63,20.32 59.31,20.32 59.05,20.07 C7.1 59.05,18.03 58.8,17.78 56.77,17.78 56.52,18.03 R15.2
  Top 0.61: IC19.2 23.49,14.73 21.72,16.51 20.7,16.51
  Top 0.813: X2.GND 20.7,16.51 X3.NEG | C20.NEG 49.66,6.35 | v49.66,5.59 49.66,6.35 | v49.66,7.11 49.66,6.35 | v99.69,12.19 97.16,12.19 | C6.1 v92.07,7.87 | 49.66,6.35 51.94,6.35 52.32,6.73 52.7,7.11 TP5.1
  pour Bottom: 233.81,24.24 15.37,24.89 15.37,17.25 1.02,17.25 1.02,7.75 15.37,7.75 15.37,0.76 233.81,0.76
  pour Top: 95.88,11.43 95.88,12.7 98.43,12.7 98.43,11.43
INT1
  Top 0.2: IC20.3 221.61,20.57 220.6,21.59
  Top 0.254: 220.6,21.59 215.77,21.59 215.26,21.08 215.26,16.51 214.5,15.75 205.61,15.75 202.06,19.3 81.41,19.3 75.31,13.21 61.59,13.21 61.24,13.56 IC1.8
INT2
  Top 0.2: IC20.5 220.81,19.52 220.34,19.05
  Top 0.254: 220.34,19.05 216.53,19.05 216.03,18.54 216.03,16.26 215.01,15.24 205.1,15.24 201.55,18.8 97.92,18.8 95.88,16.76 83.69,16.76 83.44,17.02 79.88,17.02 75.56,12.7 61.09,12.7 60.59,13.2 IC1.9
N$1
  Top 0.254: IC2.6 113.23,13.54 113.66,13.97 123.82,13.97 124.25,13.54 IC3.1
N$2
  Top 0.254: IC2.5 114.94,12.7 115.44,13.21 122.05,13.21 122.56,12.7 IC3.2
N$3
  Top 0.254: R18.2 58.95,3.81 57.78,3.81 56.2,5.4 T4.1
N$4
  Top 0.254: IC3.6 124.25,5.16 124.84,4.57 127.89,4.57 128.47,5.16 IC4.1
N$5
  Top 0.254: IC3.5 122.56,4.32 123.06,3.81 129.67,3.81 130.18,4.32 IC4.2
N$6
  Top 0.406: X2.DP 17.04,13.78 R20.1
N$7
  Top 0.254: IC4.6 128.47,13.54 128.91,13.97 139.06,13.97 139.5,13.54 IC5.1
N$8
  Top 0.254: IC4.5 130.18,12.7 130.68,13.21 137.29,13.21 137.79,12.7 IC5.2
N$9
  Top 0.406: X2.DN 17.04,11.62 R6.2
N$10
  Top 0.254: IC6.6 143.72,13.54 144.15,13.97 154.3,13.97 154.73,13.54 IC7.1
N$11
  Top 0.254: IC6.5 145.41,12.7 145.92,13.21 152.53,13.21 153.03,12.7 IC7.2
N$13
  Top 0.254: IC7.6 154.73,5.16 155.32,4.57 158.37,4.57 158.95,5.16 IC8.1
N$14
  Top 0.254: IC7.5 153.03,4.32 153.54,3.81 160.15,3.81 160.66,4.32 IC8.2
N$15
  Top 0.61: T3.4 30.1,4.89 30.36,4.64 L1.1 30.86,5.14 30.86,5.71 30.61,5.97 30.61,6.35 30.16,6.79 T3.6
N$16
  Top 0.254: IC8.6 158.95,13.54 159.38,13.97 169.54,13.97 169.97,13.54 IC9.1
N$17
  Top 0.254: IC8.5 160.66,12.7 161.16,13.21 167.77,13.21 168.28,12.7 IC9.2
N$18
  Top 0.254: TP1.TP 64.64,17.78 63.84,16.98 IC1.4
N$19
  Top 0.254: IC10.6 174.19,13.54 174.62,13.97 184.78,13.97 185.22,13.54 IC11.1
N$20
  Top 0.254: IC10.5 175.89,12.7 176.4,13.21 183.01,13.21 183.51,12.7 IC11.2
N$21  (via drill 0.5)
  Top 0.254: R15.1 v56.52,23.11 34.67,23.11 34.42,22.86 33.41,22.86 S2.3 S2.4 | IC1.1 65.87,15.75 v67.44,15.75
  Bottom 0.254: v67.44,15.75 60.07,23.11 v56.52,23.11
N$22
  Top 0.254: IC11.6 185.22,5.16 185.8,4.57 188.85,4.57 189.44,5.16 IC12.1
N$23
  Top 0.254: IC11.5 183.51,4.32 184.02,3.81 190.63,3.81 191.13,4.32 IC12.2
N$24
  Top 0.254: TP3.TP 67.01,9.73 IC1.20
N$25
  Top 0.254: IC12.6 189.44,13.54 189.86,13.97 200.03,13.97 200.45,13.54 IC13.1
N$26
  Top 0.254: IC12.5 191.13,12.7 191.64,13.21 198.25,13.21 198.75,12.7 IC13.2
N$27
  Top 0.254: IC1.19 65.14,8.39 65.41,8.13 TP2.TP
N$28
  Top 0.254: 215.52,11.47 215.52,13.46 215.01,13.97 205.1,13.97 204.67,13.54 IC14.6
  Top 0.406: IC15.1 215.52,11.47
N$29
  Top 0.254: IC14.5 206.38,12.7 206.88,13.21 213.49,13.21 214,12.7 IC15.2
N$31
  Top 0.254: 215.77,6.41 215.77,5.08 216.28,4.57 219.33,4.57 219.91,5.16 IC16.1
  Top 0.406: IC15.6 215.77,6.41
N$32
  Top 0.254: IC16.2 221.61,4.32 221.11,3.81 214.5,3.81 214,4.32 IC15.5
N$33
  Top 0.254: 46,14.22 R7.1 43.41,14.58 42.04,13.21 41.27,13.21 40.32,14.16 IC18.6 40.32,16.95 40,17.27 39.24,17.27 38.73,17.78 C19.2 38.73,19.81 38.99,20.07 41.02,20.07 41.27,20.32 R8.2
N$34
  Top 0.254: IC16.6 219.91,13.54 220.34,13.97 230.5,13.97 230.94,13.54 IC17.1
N$35
  Top 0.254: IC16.5 221.61,12.7 222.12,13.21 228.73,13.21 229.23,12.7 IC17.2
N$36
  Top 0.254: IC18.5 40.96,17.08 41.27,17.4 R8.1 R9.2
N$37
  Top 0.254: IC18.11 40.32,9.46 39.75,8.89
  Top 0.813: 39.75,8.89 37.21,8.89 36.51,8.19 L1.2 36.51,3.49 37.47,2.54 D3.A
N$38
  Top 0.254: IC5.5 137.79,4.32 138.3,3.81 144.91,3.81 145.41,4.32 IC6.2
N$39
  Top 0.254: IC5.6 139.5,5.16 140.08,4.57 143.13,4.57 143.72,5.16 IC6.1
N$40
  Top 0.254: IC18.1 43.61,15.75 48.89,15.75 | 48.89,15.75 R10.1 | R11.2 48.89,15.75
N$41
  Top 0.254: IC9.5 168.28,4.32 168.78,3.81 175.39,3.81 175.89,4.32 IC10.2
N$42
  Top 0.254: IC9.6 169.97,5.16 170.56,4.57 173.61,4.57 174.19,5.16 IC10.1
N$44
  Top 0.254: IC13.5 198.75,4.32 199.26,3.81 205.87,3.81 206.38,4.32 IC14.2
N$45
  Top 0.254: IC13.6 200.45,5.16 201.04,4.57 204.09,4.57 204.67,5.16 IC14.1
N$46
  Top 0.2: IC20.4 221.22,20.32 221.11,20.43 C21.2
N$48
  Top 0.254: C23.2 46.36,18.03 45.59,17.27 42.86,17.27 | IC18.2 42.86,17.27 | IC18.3 42.23,16.95 42.55,17.27 42.86,17.27
SCL
  Top 0.2: 222.01,20.32 IC20.2 222.01,21.19
  Top 0.254: 222.01,21.19 220.85,22.35 213.49,22.35 212.72,21.59 R12.1 212.72,19.3 212.98,19.05 214,19.05 214.5,18.54 214.5,16.76 214,16.26 206.12,16.26 202.56,19.81 81.15,19.81 75.06,13.72 64.9,13.72 64.49,14.12 IC1.3
SDA  (via drill 0.4)
  Top 0.2: IC20.10 222.41,18.58 222.88,19.05
  Top 0.254: 222.88,19.05 226.69,19.05 227.2,19.56 227.2,21.59 224.92,23.88 212.47,23.88 210.19,21.59 R13.1 209.78,20.43 209.68,20.32 v207.64,20.32 | IC1.2 65.14,14.49 65.41,14.22 74.8,14.22 80.9,20.32 203.58,20.32 v205.61,18.29
  Top 0.406: R13.1 210.19,20.32
  Bottom 0.254: v205.61,18.29 v207.64,20.32
SDI
  Top 0.254: IC1.13 61.24,5.69 61.59,5.33 68.96,5.33 70.48,3.81 71.65,3.81 R1.1 72.92,3.71 73.34,4.13 T2.2
SUPP_HOLD  (via drill 0.5)
  Top 0.254: IC1.10 59.94,14.09 v59.05,13.21 | v58.8,10.16 59.05,9.91 R18.1
  Bottom 0.254: v59.05,13.21 58.8,12.95 v58.8,10.16
USB-DN  (via drill 0.5)
  Top 0.254: IC1.17 63.84,10.96 63.12,11.68 57.78,11.68 52.7,16.76 v51.44,16.76 | R6.1 20.95,11.43 21.97,12.45 24.26,12.45 24.45,12.26 IC19.6 24.52,11.43 25.02,11.43 25.27,11.68 25.27,15.24 26.04,16 35.69,16 v35.94,16.26
  Bottom 0.254: v51.44,16.76 36.45,16.76 v35.94,16.26
USB-DP  (via drill 0.5)
  Top 0.254: IC1.18 64.49,11.33 63.63,12.19 58.04,12.19 v52.45,17.78 | R20.2 20.95,13.97 21.97,12.95 24.26,12.95 24.45,13.14 IC19.1 24.51,13.97 24.51,15.24 25.78,16.51 34.16,16.51 v34.92,17.27
  Bottom 0.254: v52.45,17.78 51.18,17.78 50.67,17.27 v34.92,17.27
USB_PRES  (via drill 0.5)
  Top 0.254: S2.2 S2.1 33.41,17.78 34.18,18.54 35.69,18.54 36.09,18.95 R16.2 36.2,17.78 37.21,16.76 v37.21,15.75 36.7,15.24 30.1,15.24 29.84,14.99 R17.2 | IC1.14 61.89,10.88 61.59,11.18 57.28,11.18 52.7,15.75 v50.16,15.75
  Bottom 0.254: v50.16,15.75 v37.21,15.75
VUSB
  Top 0.254: D2.A 29.58,11.06 R17.1
  Top 0.406: 15.88,8.89 26.04,8.89 27.3,10.16 D2.A
  Top 0.813: X2.+5V 15.88,8.89

### Text on the board
Bottom: ChrLin00 2019 | LightShaker-3 | E1962100
tPlace: Persistence Of Vision Display | GND | CI | DI | +5V
tNames: Center / of / Mass